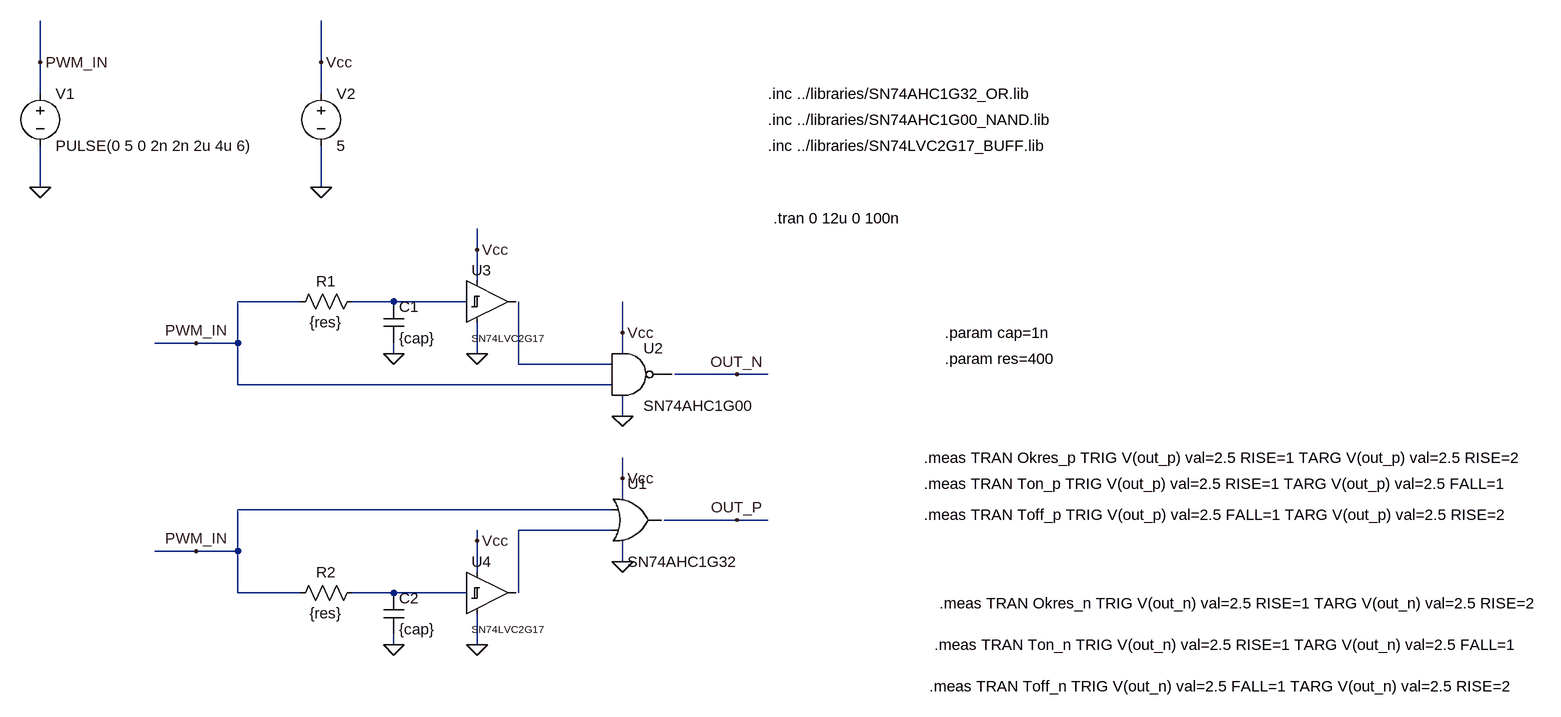
[diagram p0: schematic Deadtime_gates.asc]
Deadtime_gates.asc, the LTspice schematic file:
Version 4
SHEET 1 1604 680
WIRE -768 -384 -768 -448
WIRE -336 -384 -336 -448
WIRE -768 -336 -768 -384
WIRE -336 -336 -336 -384
WIRE -768 -192 -768 -256
WIRE -336 -192 -336 -256
WIRE -96 -96 -96 -128
WIRE -96 -48 -96 -96
WIRE -368 -16 -464 -16
WIRE -224 -16 -288 -16
WIRE -112 -16 -224 -16
WIRE 128 32 128 -16
WIRE -528 48 -592 48
WIRE -464 48 -464 -16
WIRE -464 48 -528 48
WIRE -224 64 -224 48
WIRE -96 64 -96 16
WIRE 128 64 128 32
WIRE -32 80 -32 -16
WIRE 112 80 -32 80
WIRE 304 96 208 96
WIRE 352 96 304 96
WIRE -464 112 -464 48
WIRE 112 112 -464 112
WIRE 128 160 128 128
WIRE 128 256 128 224
WIRE 128 288 128 256
WIRE 112 304 -464 304
WIRE 304 320 192 320
WIRE 352 320 304 320
WIRE 112 336 -32 336
WIRE -96 352 -96 336
WIRE -528 368 -592 368
WIRE -464 368 -464 304
WIRE -464 368 -528 368
WIRE 128 384 128 352
WIRE -96 400 -96 352
WIRE -464 432 -464 368
WIRE -368 432 -464 432
WIRE -224 432 -288 432
WIRE -112 432 -224 432
WIRE -32 432 -32 336
WIRE -224 512 -224 496
WIRE -96 512 -96 464
FLAG 128 160 0
FLAG 128 384 0
FLAG 128 32 Vcc
FLAG 128 256 Vcc
FLAG -96 512 0
FLAG -96 64 0
FLAG -96 352 Vcc
FLAG -96 -96 Vcc
FLAG -224 64 0
FLAG -224 512 0
FLAG 304 320 OUT_P
FLAG 304 96 OUT_N
FLAG -528 48 PWM_IN
FLAG -528 368 PWM_IN
FLAG -768 -192 0
FLAG -336 -192 0
FLAG -768 -384 PWM_IN
FLAG -336 -384 Vcc
SYMBOL schmitt_buffer -112 -80 R0
WINDOW 3 8 120 Left 1
SYMATTR InstName U3
SYMBOL schmitt_buffer -112 368 R0
WINDOW 3 8 120 Left 1
SYMATTR InstName U4
SYMBOL res -272 -32 R90
WINDOW 0 0 56 VBottom 2
WINDOW 3 32 56 VTop 2
SYMATTR InstName R1
SYMATTR Value {res}
SYMBOL cap -240 -16 R0
SYMATTR InstName C1
SYMATTR Value {cap}
SYMBOL res -272 416 R90
WINDOW 0 0 56 VBottom 2
WINDOW 3 32 56 VTop 2
SYMATTR InstName R2
SYMATTR Value {res}
SYMBOL cap -240 432 R0
SYMATTR InstName C2
SYMATTR Value {cap}
SYMBOL voltage -768 -352 R0
WINDOW 123 0 0 Left 0
WINDOW 39 0 0 Left 0
SYMATTR InstName V1
SYMATTR Value PULSE(0 5 0 2n 2n 2u 4u 6)
SYMBOL voltage -336 -352 R0
WINDOW 123 0 0 Left 0
WINDOW 39 0 0 Left 0
SYMATTR InstName V2
SYMATTR Value 5
SYMBOL my_or 144 256 R0
SYMATTR InstName U1
SYMBOL my_nand 144 32 R0
SYMATTR InstName U2
TEXT 352 -336 Left 2 !.inc ../libraries/SN74AHC1G32_OR.lib
TEXT 352 -296 Left 2 !.inc ../libraries/SN74AHC1G00_NAND.lib
TEXT 352 -256 Left 2 !.inc ../libraries/SN74LVC2G17_BUFF.lib
TEXT 360 -144 Left 2 !.tran 0 12u 0 100n
TEXT 624 32 Left 2 !.param cap=1n
TEXT 592 224 Left 2 !.meas TRAN Okres_p TRIG V(out_p) val=2.5 RISE=1 TARG V(out_p) val=2.5 RISE=2
TEXT 592 264 Left 2 !.meas TRAN Ton_p TRIG V(out_p) val=2.5 RISE=1 TARG V(out_p) val=2.5 FALL=1
TEXT 592 312 Left 2 !.meas TRAN Toff_p TRIG V(out_p) val=2.5 FALL=1 TARG V(out_p) val=2.5 RISE=2
TEXT 616 448 Left 2 !.meas TRAN Okres_n TRIG V(out_n) val=2.5 RISE=1 TARG V(out_n) val=2.5 RISE=2
TEXT 608 512 Left 2 !.meas TRAN Ton_n TRIG V(out_n) val=2.5 RISE=1 TARG V(out_n) val=2.5 FALL=1
TEXT 600 576 Left 2 !.meas TRAN Toff_n TRIG V(out_n) val=2.5 FALL=1 TARG V(out_n) val=2.5 RISE=2
TEXT 624 72 Left 2 !.param res=400

The netlist it stands for:
* Deadtime_gates.asc
XU3 N002 N001 Vcc 0 SN74LVC2G17  ; pins Y A VCC AGND
XU4 N003 N004 Vcc 0 SN74LVC2G17  ; pins Y A VCC AGND
R1 N001 PWM_IN {res}
C1 N001 0 {cap}
R2 N004 PWM_IN {res}
C2 N004 0 {cap}
V1 PWM_IN 0 PULSE(0 5 0 2n 2n 2u 4u 6)
V2 Vcc 0 5
XU1 OUT_P PWM_IN N003 Vcc 0 SN74AHC1G32  ; pins Y A B VCC AGND
XU2 OUT_N N002 PWM_IN Vcc 0 SN74AHC1G00  ; pins Y A B VCC AGND
.inc ../libraries/SN74AHC1G32_OR.lib
.inc ../libraries/SN74AHC1G00_NAND.lib
.inc ../libraries/SN74LVC2G17_BUFF.lib
.tran 0 12u 0 100n
.param cap=1n
.meas TRAN Okres_p TRIG V(out_p) val=2.5 RISE=1 TARG V(out_p) val=2.5 RISE=2
.meas TRAN Ton_p TRIG V(out_p) val=2.5 RISE=1 TARG V(out_p) val=2.5 FALL=1
.meas TRAN Toff_p TRIG V(out_p) val=2.5 FALL=1 TARG V(out_p) val=2.5 RISE=2
.meas TRAN Okres_n TRIG V(out_n) val=2.5 RISE=1 TARG V(out_n) val=2.5 RISE=2
.meas TRAN Ton_n TRIG V(out_n) val=2.5 RISE=1 TARG V(out_n) val=2.5 FALL=1
.meas TRAN Toff_n TRIG V(out_n) val=2.5 FALL=1 TARG V(out_n) val=2.5 RISE=2
.param res=400
.backanno
.end